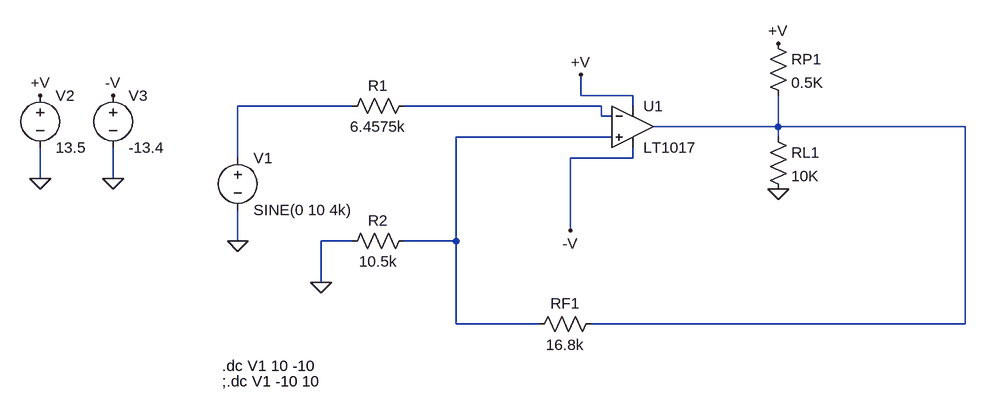
[diagram p0: schematic EJERCICO1c+5.asc]
EJERCICO1c+5.asc, the LTspice schematic file:
Version 4
SHEET 1 932 680
WIRE 336 176 336 144
WIRE 416 176 336 176
WIRE -16 192 -192 192
WIRE 368 192 64 192
WIRE 416 192 416 176
WIRE 368 208 368 192
WIRE 384 208 368 208
WIRE 640 224 640 176
WIRE 640 224 448 224
WIRE 928 224 640 224
WIRE 384 240 144 240
WIRE 640 240 640 224
WIRE -192 272 -192 192
WIRE 416 272 416 256
WIRE 416 272 320 272
WIRE -496 304 -496 256
WIRE -384 304 -384 256
WIRE 320 384 320 272
WIRE -192 400 -192 352
WIRE -16 400 -64 400
WIRE 144 400 144 240
WIRE 144 400 64 400
WIRE -64 464 -64 400
WIRE 144 528 144 400
WIRE 272 528 144 528
WIRE 928 528 928 224
WIRE 928 528 352 528
FLAG -192 400 0
FLAG -64 464 0
FLAG 336 144 +V
FLAG 320 384 -V
FLAG 640 320 0
FLAG 640 96 +V
FLAG -496 304 0
FLAG -384 304 0
FLAG -496 176 +V
FLAG -384 176 -V
SYMBOL res 80 176 R90
WINDOW 0 0 56 VBottom 2
WINDOW 3 32 56 VTop 2
SYMATTR InstName R1
SYMATTR Value 6.4575k
SYMBOL res 80 384 R90
WINDOW 0 0 56 VBottom 2
WINDOW 3 32 56 VTop 2
SYMATTR InstName R2
SYMATTR Value 10.5k
SYMBOL res 368 512 R90
WINDOW 0 0 56 VBottom 2
WINDOW 3 32 56 VTop 2
SYMATTR InstName RF1
SYMATTR Value 16.8k
SYMBOL res 624 224 R0
SYMATTR InstName RL1
SYMATTR Value 10K
SYMBOL res 624 80 R0
SYMATTR InstName RP1
SYMATTR Value 0.5K
SYMBOL LT1017 416 224 R0
SYMATTR InstName U1
SYMBOL voltage -192 256 R0
WINDOW 123 0 0 Left 2
WINDOW 39 0 0 Left 2
SYMATTR InstName V1
SYMATTR Value SINE(0 10 4k)
SYMBOL voltage -496 160 R0
WINDOW 123 0 0 Left 2
WINDOW 39 0 0 Left 2
SYMATTR InstName V2
SYMATTR Value 13.5
SYMBOL voltage -384 160 R0
WINDOW 123 0 0 Left 2
WINDOW 39 0 0 Left 2
SYMATTR InstName V3
SYMATTR Value -13.4
TEXT -216 592 Left 2 !.dc V1 10 -10
TEXT -216 616 Left 2 !;.dc V1 -10 10

The netlist it stands for:
* EJERCICO1c+5.asc
R1 N002 N001 6.4575k
R2 N004 0 10.5k
RF1 N003 N004 16.8k
RL1 N003 0 10K
RP1 +V N003 0.5K
XU1 N004 N002 +V -V N003 LT1017  ; pins In+ In- V+ V- OUT
V1 N001 0 SINE(0 10 4k)
V2 +V 0 13.5
V3 -V 0 -13.4
.dc V1 10 -10
;.dc V1 -10 10
.backanno
.end